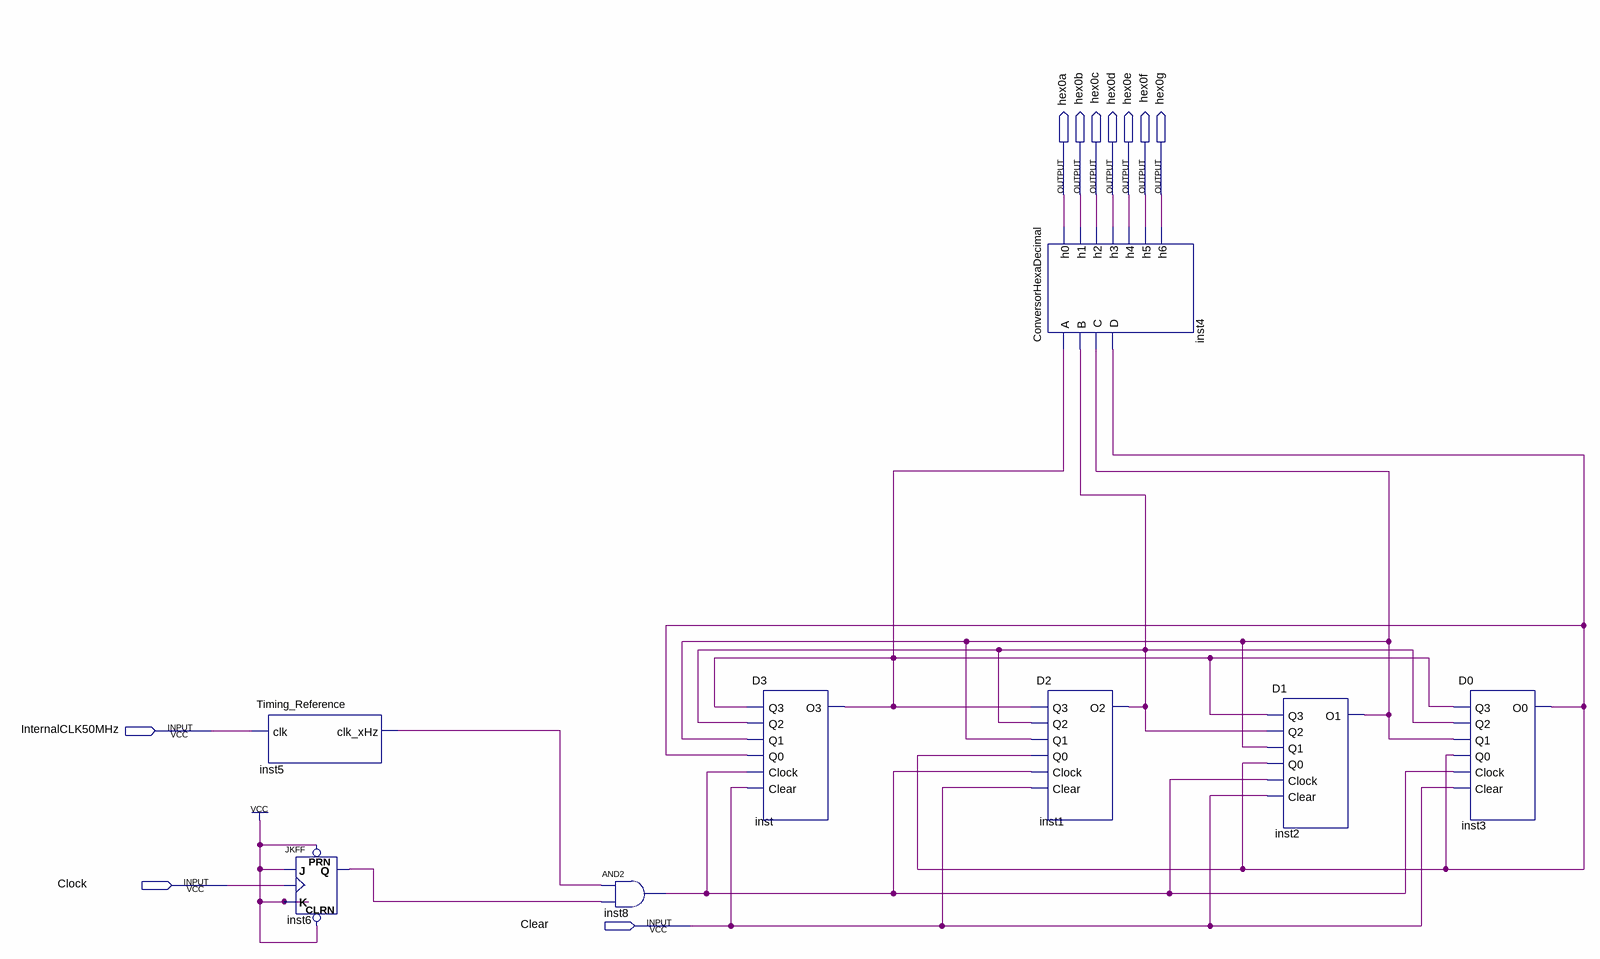
[diagram p0: schematic sheet]
// Quartus schematic LAB4.bdf as structural Verilog: 8 symbols, 10 pins
module LAB4 (
  input  InternalCLK50MHz,
  input  Clock,
  input  Clear,
  output hex0a,
  output hex0b,
  output hex0c,
  output hex0d,
  output hex0e,
  output hex0f,
  output hex0g
);

  wire inst1_o2, inst2_o1, inst3_o0, inst5_clk_xhz, inst6_q, inst8_out, inst_o3;

  Timing_Reference inst5 (.clk(InternalCLK50MHz), .clk_xHz(inst5_clk_xhz));
  JKFF inst6 (.PRN(1'b1), .CLRN(1'b1), .K(1'b1), .J(1'b1), .CLK(Clock), .Q(inst6_q));
  and inst8 (inst8_out, inst5_clk_xhz, inst6_q);
  D3 inst (.Q3(inst_o3), .Q2(inst1_o2), .Q1(inst2_o1), .Q0(inst3_o0), .Clock(inst8_out), .Clear(Clear), .O3(inst_o3));
  ConversorHexaDecimal inst4 (
    .A(inst_o3), .B(inst1_o2), .C(inst2_o1), .D(inst3_o0), .h0(hex0a), .h1(hex0b), .h2(hex0c), .h3(hex0d),
    .h4(hex0e), .h5(hex0f), .h6(hex0g));
  D2 inst1 (.Q3(inst_o3), .Q2(inst1_o2), .Q1(inst2_o1), .Q0(inst3_o0), .Clock(inst8_out), .Clear(Clear), .O2(inst1_o2));
  D1 inst2 (.Q3(inst_o3), .Q2(inst1_o2), .Q1(inst2_o1), .Q0(inst3_o0), .Clock(inst8_out), .Clear(Clear), .O1(inst2_o1));
  D0 inst3 (.Q3(inst_o3), .Q2(inst1_o2), .Q1(inst2_o1), .Q0(inst3_o0), .Clock(inst8_out), .Clear(Clear), .O0(inst3_o0));
endmodule
